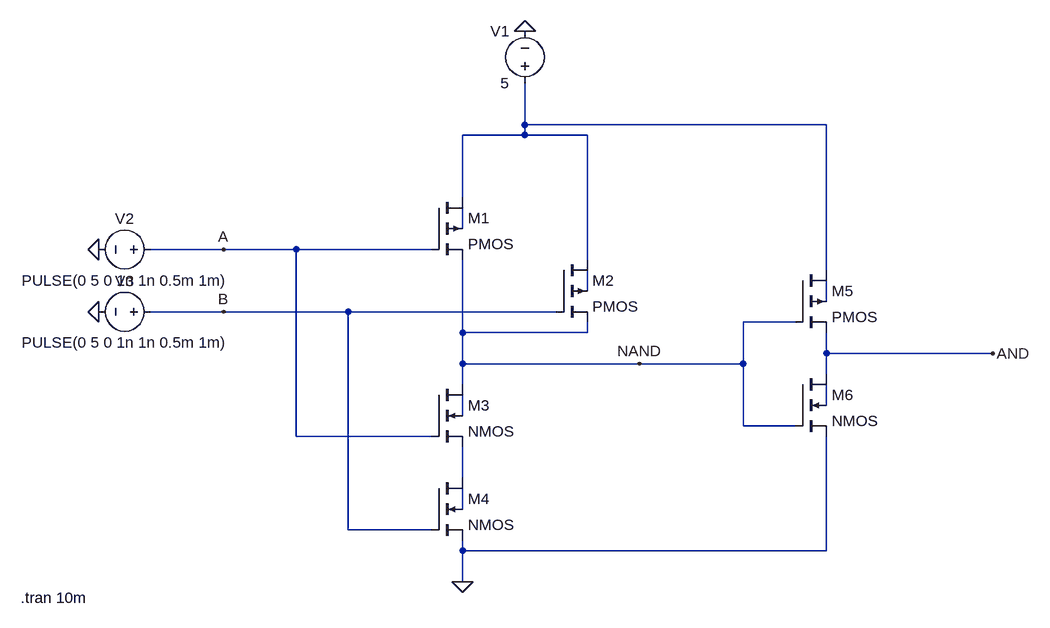
[diagram p0: schematic NAND_AND.asc]
NAND_AND.asc, the LTspice schematic file:
Version 4
SHEET 1 1060 712
WIRE 272 -32 272 -96
WIRE 736 -32 272 -32
WIRE 272 -16 272 -32
WIRE 272 -16 176 -16
WIRE 368 -16 272 -16
WIRE 176 80 176 -16
WIRE 176 128 176 96
WIRE -192 160 -304 160
WIRE -80 160 -192 160
WIRE 128 160 -80 160
WIRE 368 176 368 -16
WIRE 736 192 736 -32
WIRE 368 224 368 192
WIRE 736 240 736 208
WIRE -192 256 -304 256
WIRE 0 256 -192 256
WIRE 320 256 0 256
WIRE 688 272 608 272
WIRE 176 288 176 176
WIRE 368 288 368 272
WIRE 368 288 176 288
WIRE 736 320 736 288
WIRE 992 320 736 320
WIRE 176 336 176 288
WIRE 448 336 176 336
WIRE 608 336 608 272
WIRE 608 336 448 336
WIRE 736 352 736 320
WIRE 176 368 176 336
WIRE 736 400 736 368
WIRE 176 416 176 384
WIRE 608 432 608 336
WIRE 688 432 608 432
WIRE -80 448 -80 160
WIRE 128 448 -80 448
WIRE 176 512 176 464
WIRE 176 560 176 528
WIRE 0 592 0 256
WIRE 128 592 0 592
WIRE 176 624 176 608
WIRE 736 624 736 448
WIRE 736 624 176 624
WIRE 176 672 176 624
FLAG 176 672 0
FLAG 272 -176 0
FLAG -384 160 0
FLAG -384 256 0
FLAG -192 160 A
FLAG -192 256 B
FLAG 448 336 NAND
FLAG 992 320 AND
SYMBOL pmos4 128 80 R0
SYMATTR InstName M1
SYMBOL pmos4 320 176 R0
SYMATTR InstName M2
SYMBOL nmos4 128 368 R0
SYMATTR InstName M3
SYMBOL nmos4 128 512 R0
SYMATTR InstName M4
SYMBOL voltage 272 -80 R180
WINDOW 0 24 96 Left 2
WINDOW 3 24 16 Left 2
WINDOW 123 0 0 Left 0
WINDOW 39 0 0 Left 0
SYMATTR InstName V1
SYMATTR Value 5
SYMBOL voltage -288 160 R90
WINDOW 0 -32 56 VBottom 2
WINDOW 3 32 56 VTop 2
WINDOW 123 0 0 Left 0
WINDOW 39 0 0 Left 0
SYMATTR InstName V2
SYMATTR Value PULSE(0 5 0 1n 1n 0.5m 1m)
SYMBOL voltage -288 256 R90
WINDOW 0 -32 56 VBottom 2
WINDOW 3 32 56 VTop 2
WINDOW 123 0 0 Left 0
WINDOW 39 0 0 Left 0
SYMATTR InstName V3
SYMATTR Value PULSE(0 5 0 1n 1n 0.5m 1m)
SYMBOL pmos4 688 192 R0
SYMATTR InstName M5
SYMBOL nmos4 688 352 R0
SYMATTR InstName M6
TEXT -504 696 Left 2 !.tran 10m

The netlist it stands for:
* NAND_AND.asc
M1 N001 A NAND N002 PMOS
M2 N001 B NAND N003 PMOS
M3 NAND A N007 N006 NMOS
M4 N007 B 0 N008 NMOS
V1 N001 0 5
V2 A 0 PULSE(0 5 0 1n 1n 0.5m 1m)
V3 B 0 PULSE(0 5 0 1n 1n 0.5m 1m)
M5 N001 NAND AND N004 PMOS
M6 AND NAND 0 N005 NMOS
.model NMOS NMOS
.model PMOS PMOS
.lib standard.mos
.tran 10m
.backanno
.end